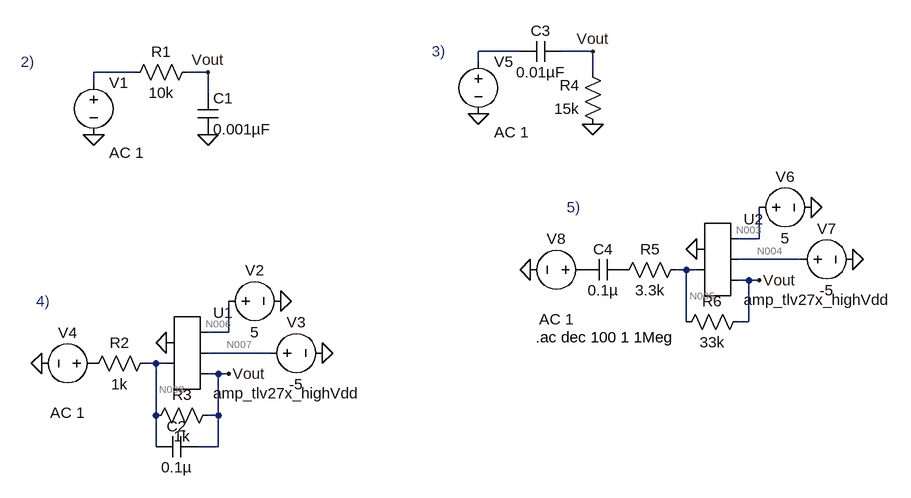
[diagram p0: schematic Lab9.asc]
* Lab9.asc
V1 N002 0 AC 1
R1 Vout N002 10k
C1 Vout 0 0.001µF
* U1: amp_tlv27x_highVdd (symbol AutoGenerated\amp_tlv27x_highVdd not available, pins judged from their places): pin1=0 pin2=N008 pin3=N006 pin4=N007 pin5=Vout
V2 N006 0 5
V3 N007 0 -5
R2 N008 P001 1k
R3 Vout N008 1k
C2 Vout N008 0.1µ
V4 P001 0 AC 1
V5 N001 0 AC 1
R4 0 Vout 15k
C3 N001 Vout 0.01µF
* U2: amp_tlv27x_highVdd (symbol AutoGenerated\amp_tlv27x_highVdd not available, pins judged from their places): pin1=0 pin2=N005 pin3=N003 pin4=N004 pin5=Vout
V6 N003 0 5
V7 N004 0 -5
R5 N005 P002 3.3k
R6 Vout N005 33k
C4 P002 P003 0.1µ
V8 P003 0 AC 1
.ac dec 100 1 1Meg
* 2)
* 3)
* 4)
* 5)
.backanno
.end

* Results of the author's LTspice run, read from the files saved beside the schematic
* Operating Point, zero values left out:
*   V(vout) = -373.5 µV
*   V(n007) = -5 V
*   V(n006) = 5 V
*   V(n008) = -186.8 µV
*   V(n004) = -5 V
*   V(n003) = 5 V
*   V(n005) = -373.3 µV
*   V(p002) = -373.3 µV
*   I(R6) = -6.901 pA
*   I(R4) = 24.9 nA
*   I(R3) = -186.8 nA
*   I(R2) = -186.8 nA
*   I(R1) = -37.35 nA
*   I(V7) = 67.78 µA
*   I(V6) = -67.78 µA
*   I(V4) = -186.8 nA
*   I(V3) = 67.78 µA
*   I(V2) = -67.78 µA
*   I(V1) = -37.35 nA
*   Ix(u1:1) = -6.9 pA
*   Ix(u1:2) = -6.901 pA
*   Ix(u1:3) = 67.78 µA
*   Ix(u1:4) = -67.78 µA
*   Ix(u1:5) = 14.58 mA
*   Ix(u2:1) = -6.9 pA
*   Ix(u2:2) = -6.901 pA
*   Ix(u2:3) = 67.78 µA
*   Ix(u2:4) = -67.78 µA
*   Ix(u2:5) = -14.58 mA
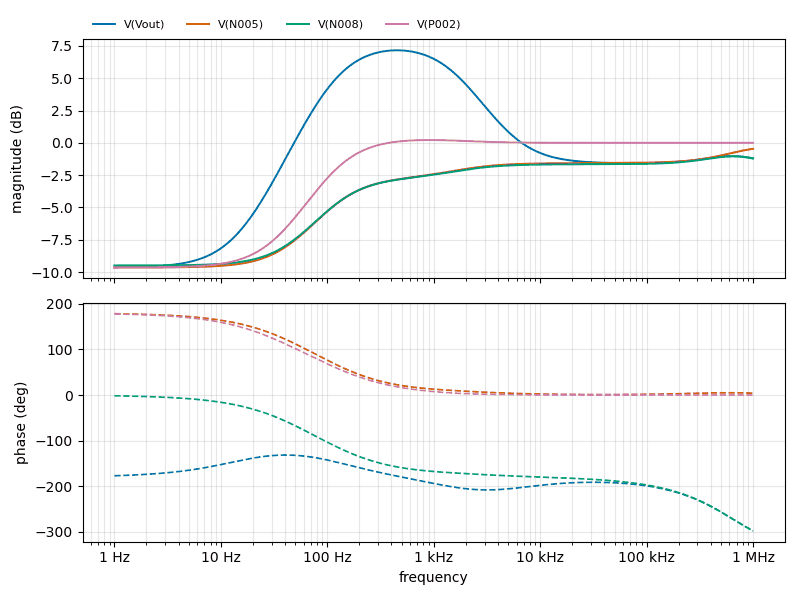
[diagram p1: AC Analysis of Lab9.asc, plotted from the saved traces]
* AC Analysis, 1 run:
*   V(Vout): -9.63 dB at 1 Hz, -1.20 dB at 1 MHz, peak 7.16 dB at 446.7 Hz, 3 dB below the peak at 99.61 Hz and 2.2 kHz
*   V(N005): -9.65 dB at 1 Hz, -0.46 dB at 1 MHz, peak -0.46 dB at 1 MHz, 3 dB below the peak at 223 Hz
*   V(N008): -9.49 dB at 1 Hz, -1.21 dB at 1 MHz, peak -1.05 dB at 645.7 kHz, 3 dB below the peak at 159.7 Hz
*   V(P002): -9.64 dB at 1 Hz, 0.00 dB at 1 MHz, peak 0.22 dB at 912 Hz, 3 dB below the peak at 98.29 Hz